# Altium schematic sheet Preamp1_schematic.SchDoc
size A4; SheetNumber: 1; SheetTotal: 3
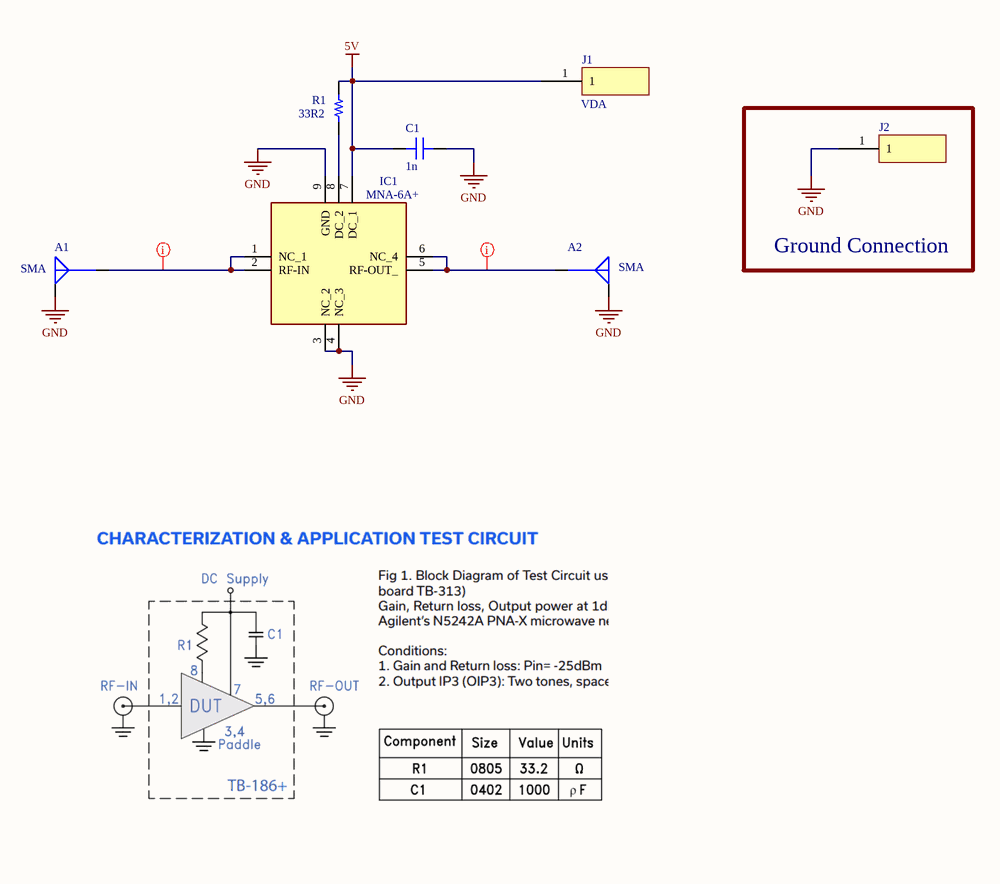
[diagram p0: Preamp1_schematic.SchDoc]

## Parts
A1  Connector Style: SMA  [MOLEX SD-73251-115]  (hidden comment: 0732511150)
A2  Connector Style: SMA  [MOLEX SD-73251-115]  (hidden comment: 0732511150)
C1  1n  [CAP 0603_1608 RF]
IC1  MNA-6A+  [MNA6A]
J1  Nail_Head  [Nail_Head]  (value not drawn)
J2  Nail_Head  [Nail_Head]  (value not drawn)
R1  33R2  [RES 0805_2012]

## Blocks framed on the sheet
Ground Connection: J2

## Nets
5V: C1.1 IC1.7(DC_1) J1.1 R1.2
GND: A1.G A2.G C1.2 IC1.3(NC_2) IC1.4(NC_3) IC1.9(GND) J2.1
NetA1_S: A1.S IC1.1(NC_1) IC1.2(RF-IN)
NetA2_S: A2.S IC1.5(RF-OUT_) IC1.6(NC_4)
NetIC1_8: IC1.8(DC_2) R1.1

## Layout directives
net class CPWG: NetA1_S, NetA2_S

## Notes on the sheet
- (near J1) VDA

## Library data of the parts
A1 A2 = 0732511150: CONN SMA RCPT STR 50OHM EDGE MNT; Manufacturer: Molex; Connector Type: Receptacle, Female Socket; Contact Termination: Solder; Frequency - Max: 18 GHz; Number of Ports: 1; Part Number: 0732511150; ComponentLink1Description: Datasheet; ComponentLink1URL: https://www.molex.com/pdm_docs/ps/PS-89675-346.pdf; ComponentLink2Description: DigiKey Link; ComponentLink2URL: https://www.digikey.com/en/products/detail/molex/0732511150/1465156; Fastening Type: Threaded; Housing Color: Gold; Impedance: 50Ohm; LastUpdated: 29/06/2022 18:06:18; Lifecycle Status: Active; Minimum Order: 1; Mounting Type: Board Edge, End Launch; Packaging: Tray; Part Status: Active; Price: 2.16; Series: 73251; Shield Termination: Solder; Supplier 1: DigiKey; Supplier Part Number 1: WM5534-ND
C1 = UMK107SD102JA-T: CAP CER 1000PF 50V 0603; manufacturer: Taiyo Yuden; Tolerance: ±5%; Part Number: UMK107SD102JA-T; Applications: RF, Microwave, High Frequency; Capacitance: 1000pF; componentlink1description: Datasheet; componentlink1url: http://www.yuden.co.jp/productdata/catalog/mlcc07_e.pdf; componentlink2description: DigiKey Link; componentlink2url: http://digikey.com/product-detail/en/taiyo-yuden/UMK107SD102JA-T/587-1069-1-ND/930846; Device Package: 0603 (1608 Metric); Features: Low Distortion; lastupdated: 02/09/2020 01:17:16; Lifecycle Status: Active; Minimum Order: 1; Mounting Type: Surface Mount, MLCC; Operating Temperature: -55°C ~ 125°C; Package / Case: 0603 (1608 Metric); packaging: TapeAndReel; partid: 885; Part Status: Active; price: 0.07; series: CFCAP™; Size / Dimension: 0.063" L x 0.031" W (1.60mm x 0.80mm); Supplier 1: DigiKey; Supplier Part Number 1: 587-1069-1-ND; Thickness (Max): 0.035" (0.90mm); value: 1000pF; Voltage - Rated: 50V
IC1 = MNA-6A+: Integrated Circuit; Manufacturer_Name: Mini-Circuits; Height: 0.9916mm; Manufacturer_Part_Number: MNA-6A+; Mouser Part Number: 139-MNA-6A; Mouser Price/Stock: https://www.mouser.co.uk/ProductDetail/Mini-Circuits/MNA-6A%2b?qs=xZ%2FP%252Ba9zWqa51VJkRRE67Q%3D%3D; Supplier 1: Digi-Key; Supplier Part Number 1: 3157-MNA-6A+CT-ND
J1 J2 = Nail_Head: 1460-2-00-80-00-00-03-0 Mill-Max; Supplier 1: Farnell; Supplier Part Number 1: 3889056
R1 = RCS080533R2FKEA: RES SMD 33.2 OHM 1% 1/2W 0805; Manufacturer: Vishay Dale; Power (Watts): 0.5W, 1/2W; Resistance: 33.2 Ohms; Temperature Coefficient: ±100ppm/°C; Part Number: RCS080533R2FKEA; Value: 33R2; ComponentLink1Description: Datasheet; ComponentLink1URL: http://www.vishay.com/docs/20065/rcse3.pdf; ComponentLink2Description: DigiKey Link; ComponentLink2URL: https://www.digikey.com/en/products/detail/vishay-dale/RCS080533R2FKEA/5866976; Composition: Thick Film; Device Package: 0805 (2012 Metric); Features: Automotive AEC-Q200, Pulse Withstanding; Height - Seated (Max): 0.020" (0.50mm); LastUpdated: 21/05/2023 19:41:30; Lifecycle Status: Active; Minimum Order: 1; Number of Terminations: 2; Operating Temperature: -55°C ~ 155°C; Package / Case: 0805 (2012 Metric); Packaging: TapeAndReel; PartId: 34966; Part Status: Active; Price: 0.02; Ratings: AEC-Q200; Series: RCS e3; Size / Dimension: 0.079" L x 0.049" W (2.00mm x 1.25mm); Supplier 1: DigiKey; Supplier Part Number 1: 541-2830-1-ND; Supplier Device Package: 0805; Tolerance: ±1%